# Altium project MB.PrjPcb (part 2 of 3)

## Sheet MB_pl_io.SchDoc: Материнская плата
size 420 x 297 mm; DrawnBy: В.Титов; DocumentNumber: ХХХХ.468179.001 Э3; SheetNumber: 4; SheetTotal: 7; DocumentType: Схема электрическая принципиальная; Title2: Питание процессора
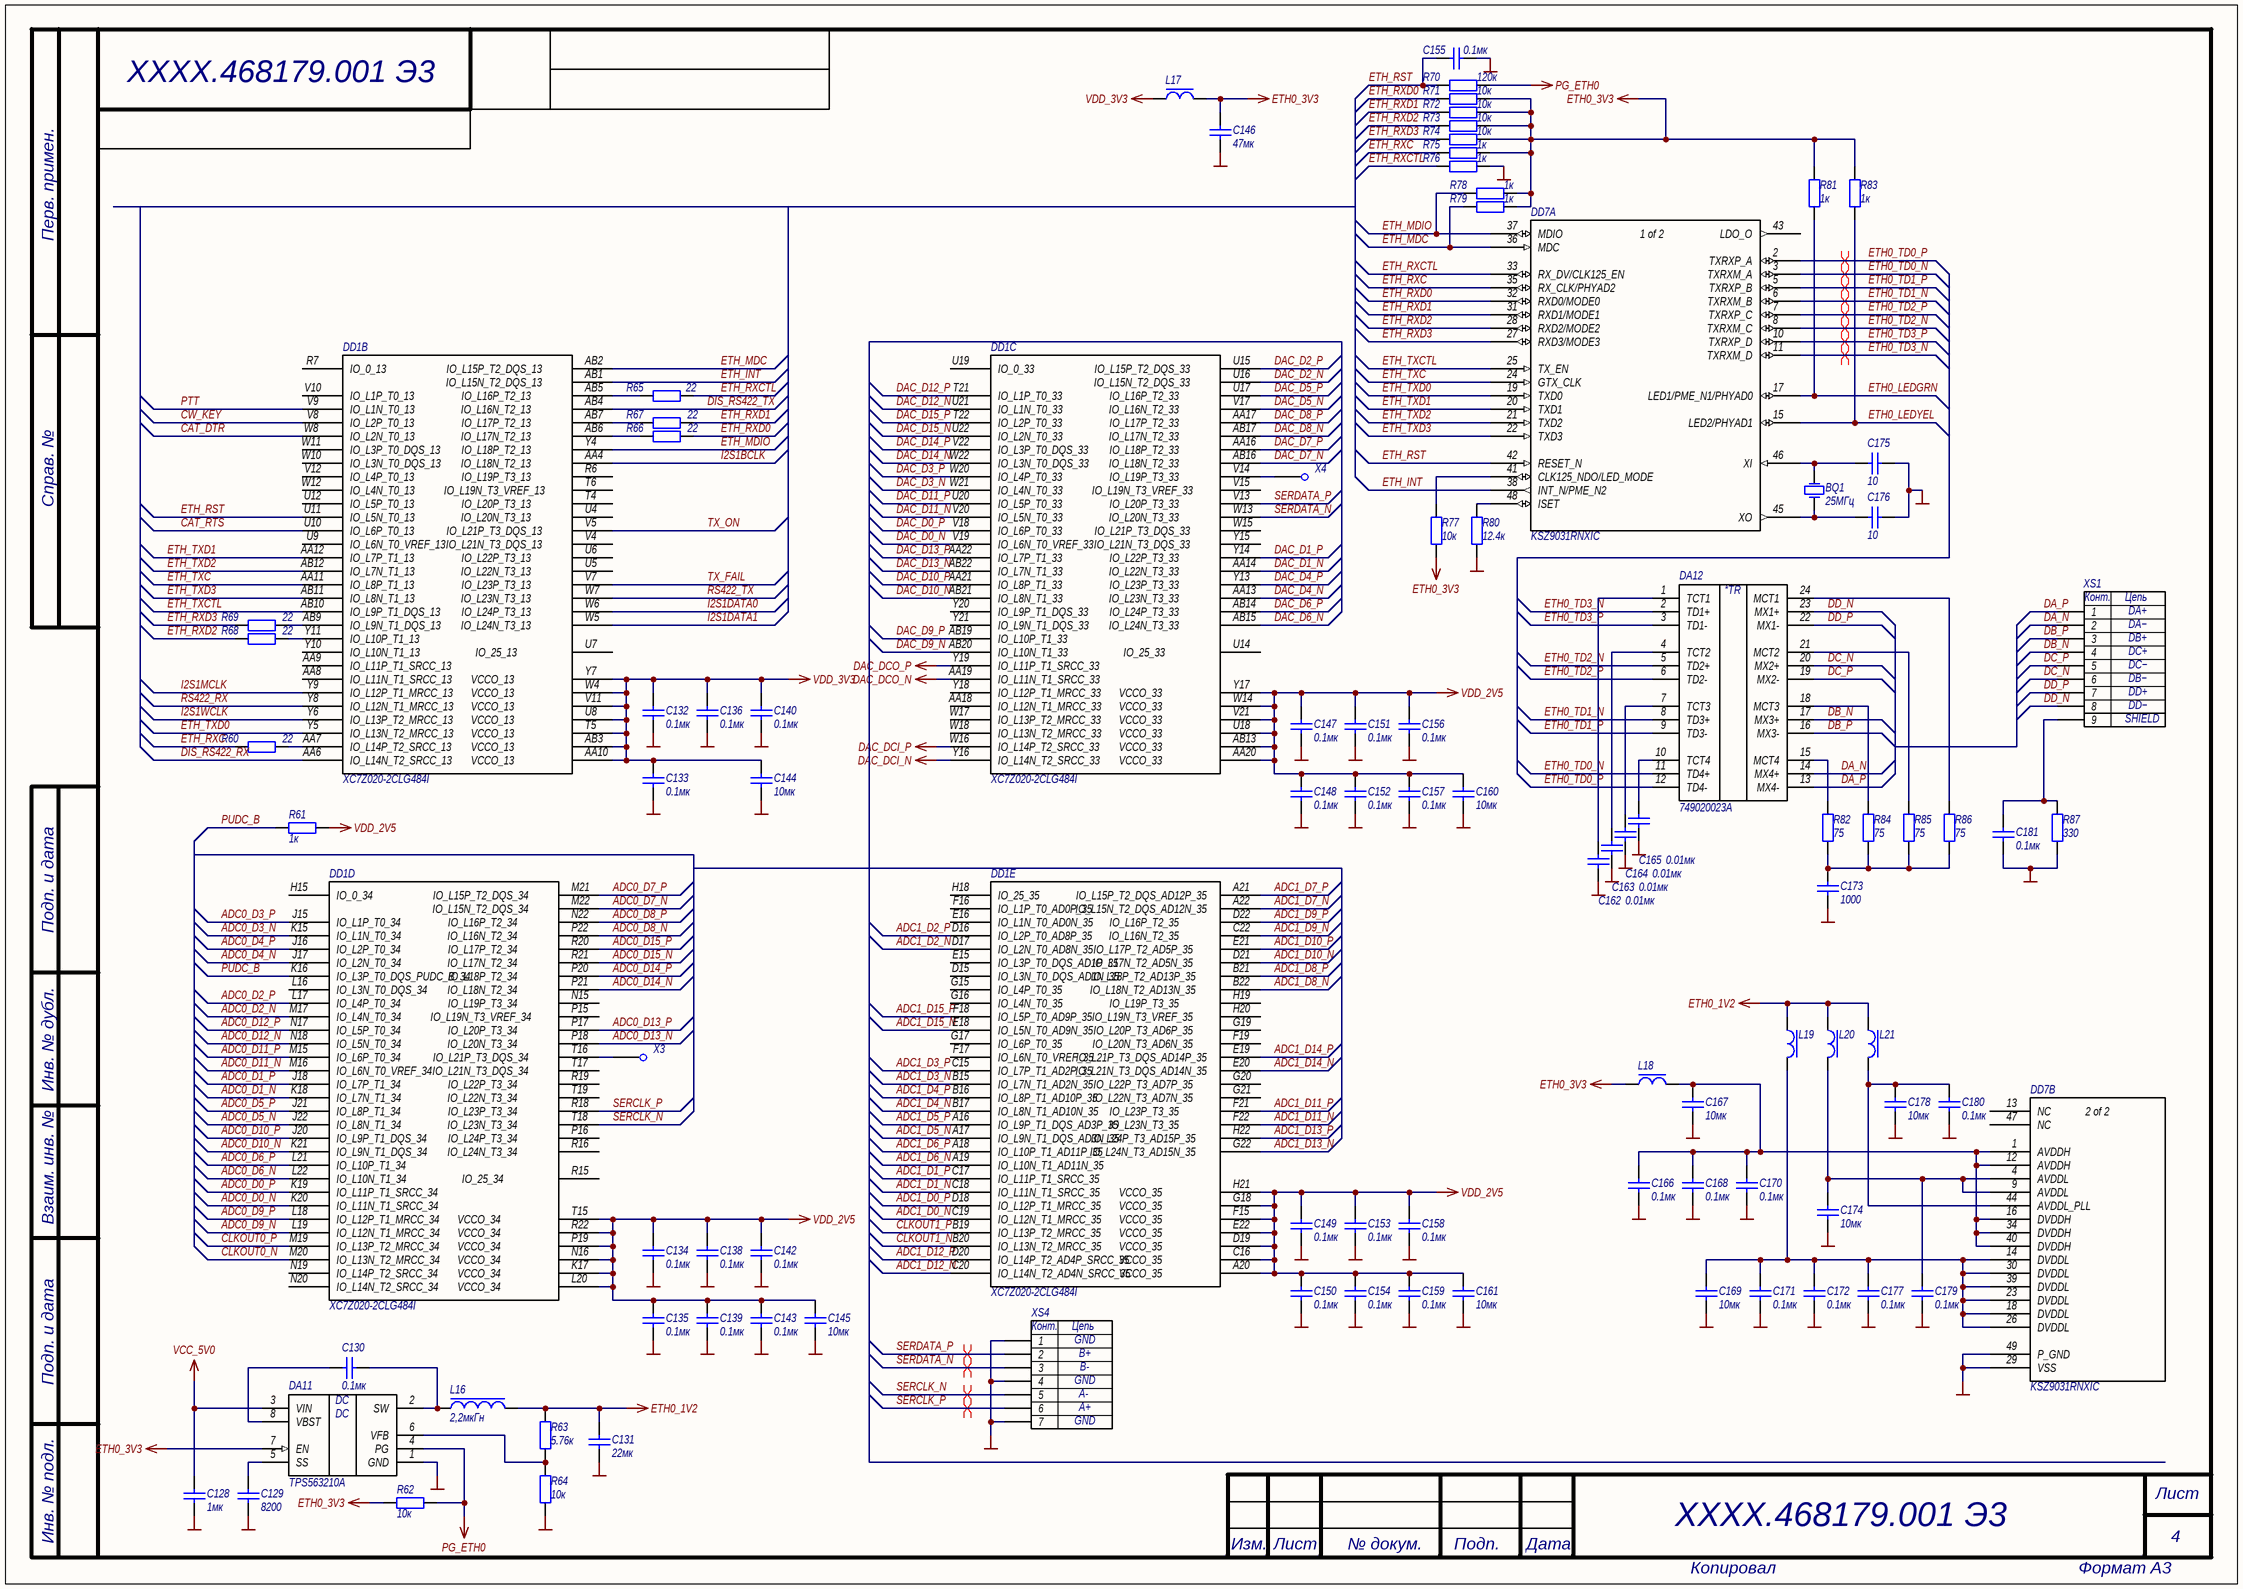
[diagram p3: MB_pl_io.SchDoc]

### Parts
BQ1  25МГц  [ABRACOM ABM10]
C128  1мк  [CAPC1005X06N]
C129  8200  [CAPC1005X06N]
C130  0.1мк  [CAPC1005X06N]
C131  22мк  [CAPC2012X12L]
C132  0.1мк  [CAPC1005X06N]
C133  0.1мк  [CAPC1005X06N]
C134  0.1мк  [CAPC1005X06N]
C135  0.1мк  [CAPC1005X06N]
C136  0.1мк  [CAPC1005X06N]
C138  0.1мк  [CAPC1005X06N]
C139  0.1мк  [CAPC1005X06N]
C140  0.1мк  [CAPC1005X06N]
C142  0.1мк  [CAPC1005X06N]
C143  0.1мк  [CAPC1005X06N]
C144  10мк  [CAPC1608X08L]
C145  10мк  [CAPC1608X08L]
C146  47мк  [CAPC2012X12L]
C147  0.1мк  [CAPC1005X06N]
C148  0.1мк  [CAPC1005X06N]
C149  0.1мк  [CAPC1005X06N]
C150  0.1мк  [CAPC1005X06N]
C151  0.1мк  [CAPC1005X06N]
C152  0.1мк  [CAPC1005X06N]
C153  0.1мк  [CAPC1005X06N]
C154  0.1мк  [CAPC1005X06N]
C155  0.1мк  [CAPC1005X06N]
C156  0.1мк  [CAPC1005X06N]
C157  0.1мк  [CAPC1005X06N]
C158  0.1мк  [CAPC1005X06N]
C159  0.1мк  [CAPC1005X06N]
C160  10мк  [CAPC1608X08L]
C161  10мк  [CAPC1608X08L]
C162  0.01мк  [CAPC1005X06N]
C163  0.01мк  [CAPC1005X06N]
C164  0.01мк  [CAPC1005X06N]
C165  0.01мк  [CAPC1005X06N]
C166  0.1мк  [CAPC1005X06N]
C167  10мк  [CAPC1608X08L]
C168  0.1мк  [CAPC1005X06N]
C169  10мк  [CAPC1608X08L]
C170  0.1мк  [CAPC1005X06N]
C171  0.1мк  [CAPC1005X06N]
C172  0.1мк  [CAPC1005X06N]
C173  1000  [CAPC1005X06N]
C174  10мк  [CAPC1608X08L]
C175  10  [CAPC1005X06N]
C176  10  [CAPC1005X06N]
C177  0.1мк  [CAPC1005X06N]
C178  10мк  [CAPC1608X08L]
C179  0.1мк  [CAPC1005X06N]
C180  0.1мк  [CAPC1005X06N]
C181  0.1мк  [CAPC1608X08L]
DA11  TPS563210A  [TSOP65P280X110-8N]
DA12  749020023A  [749020023A]
DD1  XC7Z020-2CLG484I  [BGA484C80P22X22_1900X1900X160]  (parts B,C,D,E of 9)
DD7  KSZ9031RNXIC  [QFN50P700X700-48V6M]  (parts A,B of 2)
L16  2,2мкГн  [CSAB0420]
L17  BLM18PG121SN1D  [INDC1608X08L]  (value not drawn)
L18  BLM18PG121SN1D  [INDC1608X08L]  (value not drawn)
L19  BLM18PG121SN1D  [INDC1608X08L]  (value not drawn)
L20  BLM18PG121SN1D  [INDC1608X08L]  (value not drawn)
L21  BLM18PG121SN1D  [INDC1608X08L]  (value not drawn)
R60  22  [RESC1005X06N]
R61  1к  [RESC1005X06N]
R62  10к  [RESC1005X06N]
R63  5.76к  [RESC1005X06N]
R64  10к  [RESC1005X06N]
R65  22  [RESC1005X06N]
R66  22  [RESC1005X06N]
R67  22  [RESC1005X06N]
R68  22  [RESC1005X06N]
R69  22  [RESC1005X06N]
R70  120к  [RESC1005X06N]
R71  10к  [RESC1005X06N]
R72  10к  [RESC1005X06N]
R73  10к  [RESC1005X06N]
R74  10к  [RESC1005X06N]
R75  1к  [RESC1005X06N]
R76  1к  [RESC1005X06N]
R77  10к  [RESC1005X06N]
R78  1к  [RESC1005X06N]
R79  1к  [RESC1005X06N]
R80  12.4к  [RESC1005X06N]
R81  1к  [RESC1005X06N]
R82  75  [RESC1005X06N]
R83  1к  [RESC1005X06N]
R84  75  [RESC1005X06N]
R85  75  [RESC1005X06N]
R86  75  [RESC1005X06N]
R87  330  [RESC1005X06N]
X3  Конструктивный элемент  [PIN2_PROBE]  (value not drawn)  (no BOM)
X4  Конструктивный элемент  [PIN2_PROBE]  (value not drawn)  (no BOM)
XS1  TJ16S-8P8C  [KLS12-107L]  (value not drawn)
XS4  KLS1-SATA001  [KLS1-SATA001]  (value not drawn)

### Nets
DAC_DCI_N: DD1.Y16(IO_L14N_T2_SRCC_33)
DAC_DCI_P: DD1.W16(IO_L14P_T2_SRCC_33)
DAC_DCO_N: DD1.AA19(IO_L11N_T1_SRCC_33)
DAC_DCO_P: DD1.Y19(IO_L11P_T1_SRCC_33)
ETH0_1V2: C131.2 L16.2 L19.1 L20.1 L21.1 R63.2
ETH0_3V3: C146.2 DA11.7(EN) L17.2 L18.1 R62.2 R71.2 R72.2 R73.2 R74.2 R75.2 R77.2 R78.2 R79.2 R81.1 R83.1
GND: C128.1 C129.1 C131.1 C132.1 C133.1 C134.1 C135.1 C136.1 C138.1 C139.1 C140.1 C142.1 C143.1 C144.1 C145.1 C146.1 C147.1 C148.1 C149.1 C150.1 C151.1 C152.1 C153.1 C154.1 C155.1 C156.1 C157.1 C158.1 C159.1 C160.1 C161.1 C162.1 C163.1 C164.1 C165.1 C166.1 C167.1 C168.1 C169.1 C170.1 C171.1 C172.1 C173.2 C174.1 C175.1 C176.1 C177.1 C178.1 C179.1 C180.1 C181.2 DA11.1(GND) DD7.29(VSS) DD7.49(P_GND) R64.2 R76.2 R80.2 R87.2 XS4.1 XS4.4 XS4.7
PG_ETH0: DA11.4(PG) R62.1 R70.2
VCC_5V0: C128.2 DA11.3(VIN)
VDD_2V5: C134.2 C135.2 C138.2 C139.2 C142.2 C143.2 C145.2 C147.2 C148.2 C149.2 C150.2 C151.2 C152.2 C153.2 C154.2 C156.2 C157.2 C158.2 C159.2 C160.2 C161.2 DD1.A20(VCCO_35) DD1.AA20(VCCO_33) DD1.AB13(VCCO_33) DD1.C16(VCCO_35) DD1.D19(VCCO_35) DD1.E22(VCCO_35) DD1.F15(VCCO_35) DD1.G18(VCCO_35) DD1.H21(VCCO_35) DD1.K17(VCCO_34) DD1.L20(VCCO_34) DD1.N16(VCCO_34) DD1.P19(VCCO_34) DD1.R22(VCCO_34) DD1.T15(VCCO_34) DD1.U18(VCCO_33) DD1.V21(VCCO_33) DD1.W14(VCCO_33) DD1.Y17(VCCO_33) R61.2
VDD_3V3: C132.2 C133.2 C136.2 C140.2 C144.2 DD1.AA10(VCCO_13) DD1.AB3(VCCO_13) DD1.T5(VCCO_13) DD1.U8(VCCO_13) DD1.V11(VCCO_13) DD1.W4(VCCO_13) DD1.Y7(VCCO_13) L17.1
ADC0_D0_N: DD1.K20(IO_L11N_T1_SRCC_34)
ADC0_D0_P: DD1.K19(IO_L11P_T1_SRCC_34)
ADC0_D1_N: DD1.K18(IO_L7N_T1_34)
ADC0_D1_P: DD1.J18(IO_L7P_T1_34)
ADC0_D2_N: DD1.M17(IO_L4N_T0_34)
ADC0_D2_P: DD1.L17(IO_L4P_T0_34)
ADC0_D3_N: DD1.K15(IO_L1N_T0_34)
ADC0_D3_P: DD1.J15(IO_L1P_T0_34)
ADC0_D4_N: DD1.J17(IO_L2N_T0_34)
ADC0_D4_P: DD1.J16(IO_L2P_T0_34)
ADC0_D5_N: DD1.J22(IO_L8N_T1_34)
ADC0_D5_P: DD1.J21(IO_L8P_T1_34)
ADC0_D6_N: DD1.L22(IO_L10N_T1_34)
ADC0_D6_P: DD1.L21(IO_L10P_T1_34)
ADC0_D7_N: DD1.M22(IO_L15N_T2_DQS_34)
ADC0_D7_P: DD1.M21(IO_L15P_T2_DQS_34)
ADC0_D8_N: DD1.P22(IO_L16N_T2_34)
ADC0_D8_P: DD1.N22(IO_L16P_T2_34)
ADC0_D9_N: DD1.L19(IO_L12N_T1_MRCC_34)
ADC0_D9_P: DD1.L18(IO_L12P_T1_MRCC_34)
ADC0_D10_N: DD1.K21(IO_L9N_T1_DQS_34)
ADC0_D10_P: DD1.J20(IO_L9P_T1_DQS_34)
ADC0_D11_N: DD1.M16(IO_L6N_T0_VREF_34)
ADC0_D11_P: DD1.M15(IO_L6P_T0_34)
ADC0_D12_N: DD1.N18(IO_L5N_T0_34)
ADC0_D12_P: DD1.N17(IO_L5P_T0_34)
ADC0_D13_N: DD1.P18(IO_L20N_T3_34)
ADC0_D13_P: DD1.P17(IO_L20P_T3_34)
ADC0_D14_N: DD1.P21(IO_L18N_T2_34)
ADC0_D14_P: DD1.P20(IO_L18P_T2_34)
ADC0_D15_N: DD1.R21(IO_L17N_T2_34)
ADC0_D15_P: DD1.R20(IO_L17P_T2_34)
ADC1_D0_N: DD1.C19(IO_L12N_T1_MRCC_35)
ADC1_D0_P: DD1.D18(IO_L12P_T1_MRCC_35)
ADC1_D1_N: DD1.C18(IO_L11N_T1_SRCC_35)
ADC1_D1_P: DD1.C17(IO_L11P_T1_SRCC_35)
ADC1_D2_N: DD1.D17(IO_L2N_T0_AD8N_35)
ADC1_D2_P: DD1.D16(IO_L2P_T0_AD8P_35)
ADC1_D3_N: DD1.B15(IO_L7N_T1_AD2N_35)
ADC1_D3_P: DD1.C15(IO_L7P_T1_AD2P_35)
ADC1_D4_N: DD1.B17(IO_L8N_T1_AD10N_35)
ADC1_D4_P: DD1.B16(IO_L8P_T1_AD10P_35)
ADC1_D5_N: DD1.A17(IO_L9N_T1_DQS_AD3N_35)
ADC1_D5_P: DD1.A16(IO_L9P_T1_DQS_AD3P_35)
ADC1_D6_N: DD1.A19(IO_L10N_T1_AD11N_35)
ADC1_D6_P: DD1.A18(IO_L10P_T1_AD11P_35)
ADC1_D7_N: DD1.A22(IO_L15N_T2_DQS_AD12N_35)
ADC1_D7_P: DD1.A21(IO_L15P_T2_DQS_AD12P_35)
ADC1_D8_N: DD1.B22(IO_L18N_T2_AD13N_35)
ADC1_D8_P: DD1.B21(IO_L18P_T2_AD13P_35)
ADC1_D9_N: DD1.C22(IO_L16N_T2_35)
ADC1_D9_P: DD1.D22(IO_L16P_T2_35)
ADC1_D10_N: DD1.D21(IO_L17N_T2_AD5N_35)
ADC1_D10_P: DD1.E21(IO_L17P_T2_AD5P_35)
ADC1_D11_N: DD1.F22(IO_L23N_T3_35)
ADC1_D11_P: DD1.F21(IO_L23P_T3_35)
ADC1_D12_N: DD1.C20(IO_L14N_T2_AD4N_SRCC_35)
ADC1_D12_P: DD1.D20(IO_L14P_T2_AD4P_SRCC_35)
ADC1_D13_N: DD1.G22(IO_L24N_T3_AD15N_35)
ADC1_D13_P: DD1.H22(IO_L24P_T3_AD15P_35)
ADC1_D14_N: DD1.E20(IO_L21N_T3_DQS_AD14N_35)
ADC1_D14_P: DD1.E19(IO_L21P_T3_DQS_AD14P_35)
ADC1_D15_N: DD1.E18(IO_L5N_T0_AD9N_35)
ADC1_D15_P: DD1.F18(IO_L5P_T0_AD9P_35)
CAT_DTR: DD1.W8(IO_L2N_T0_13)
CAT_RTS: DD1.U10(IO_L6P_T0_13)
CLKOUT0_N: DD1.M20(IO_L13N_T2_MRCC_34)
CLKOUT0_P: DD1.M19(IO_L13P_T2_MRCC_34)
CLKOUT1_N: DD1.B20(IO_L13N_T2_MRCC_35)
CLKOUT1_P: DD1.B19(IO_L13P_T2_MRCC_35)
CW_KEY: DD1.V8(IO_L2P_T0_13)
DA_N: DA12.14(MX4+) XS1.2
DA_P: DA12.13(MX4-) XS1.1
DAC_D0_N: DD1.V19(IO_L6N_T0_VREF_33)
DAC_D0_P: DD1.V18(IO_L6P_T0_33)
DAC_D1_N: DD1.AA14(IO_L22N_T3_33)
DAC_D1_P: DD1.Y14(IO_L22P_T3_33)
DAC_D2_N: DD1.U16(IO_L15N_T2_DQS_33)
DAC_D2_P: DD1.U15(IO_L15P_T2_DQS_33)
DAC_D3_N: DD1.W21(IO_L4N_T0_33)
DAC_D3_P: DD1.W20(IO_L4P_T0_33)
DAC_D4_N: DD1.AA13(IO_L23N_T3_33)
DAC_D4_P: DD1.Y13(IO_L23P_T3_33)
DAC_D5_N: DD1.V17(IO_L16N_T2_33)
DAC_D5_P: DD1.U17(IO_L16P_T2_33)
DAC_D6_N: DD1.AB15(IO_L24N_T3_33)
DAC_D6_P: DD1.AB14(IO_L24P_T3_33)
DAC_D7_N: DD1.AB16(IO_L18N_T2_33)
DAC_D7_P: DD1.AA16(IO_L18P_T2_33)
DAC_D8_N: DD1.AB17(IO_L17N_T2_33)
DAC_D8_P: DD1.AA17(IO_L17P_T2_33)
DAC_D9_N: DD1.AB20(IO_L10N_T1_33)
DAC_D9_P: DD1.AB19(IO_L10P_T1_33)
DAC_D10_N: DD1.AB21(IO_L8N_T1_33)
DAC_D10_P: DD1.AA21(IO_L8P_T1_33)
DAC_D11_N: DD1.V20(IO_L5N_T0_33)
DAC_D11_P: DD1.U20(IO_L5P_T0_33)
DAC_D12_N: DD1.U21(IO_L1N_T0_33)
DAC_D12_P: DD1.T21(IO_L1P_T0_33)
DAC_D13_N: DD1.AB22(IO_L7N_T1_33)
DAC_D13_P: DD1.AA22(IO_L7P_T1_33)
DAC_D14_N: DD1.W22(IO_L3N_T0_DQS_33)
DAC_D14_P: DD1.V22(IO_L3P_T0_DQS_33)
DAC_D15_N: DD1.U22(IO_L2N_T0_33)
DAC_D15_P: DD1.T22(IO_L2P_T0_33)
DB_N: DA12.17(MX3+) XS1.4
DB_P: DA12.16(MX3-) XS1.3
DC_N: DA12.20(MX2+) XS1.6
DC_P: DA12.19(MX2-) XS1.5
DD_N: DA12.23(MX1+) XS1.8
DD_P: DA12.22(MX1-) XS1.7
DIS_RS422_RX: DD1.AA6(IO_L14N_T2_SRCC_13)
DIS_RS422_TX: DD1.AB4(IO_L16N_T2_13)
ETH0_LEDGRN: DD7.17(LED1/PME_N1/PHYAD0) R81.2
ETH0_LEDYEL: DD7.15(LED2/PHYAD1) R83.2
ETH0_TD0_N: DA12.11(TD4+) DD7.3(TXRXM_A)
ETH0_TD0_P: DA12.12(TD4-) DD7.2(TXRXP_A)
ETH0_TD1_N: DA12.8(TD3+) DD7.6(TXRXM_B)
ETH0_TD1_P: DA12.9(TD3-) DD7.5(TXRXP_B)
ETH0_TD2_N: DA12.5(TD2+) DD7.8(TXRXM_C)
ETH0_TD2_P: DA12.6(TD2-) DD7.7(TXRXP_C)
ETH0_TD3_N: DA12.2(TD1+) DD7.11(TXRXM_D)
ETH0_TD3_P: DA12.3(TD1-) DD7.10(TXRXP_D)
ETH_INT: DD1.AB1(IO_L15N_T2_DQS_13) DD7.38(INT_N/PME_N2)
ETH_MDC: DD1.AB2(IO_L15P_T2_DQS_13) DD7.36(MDC) R79.1
ETH_MDIO: DD1.Y4(IO_L18P_T2_13) DD7.37(MDIO) R78.1
ETH_RST: C155.2 DD1.U11(IO_L5N_T0_13) DD7.42(RESET_N) R70.1
ETH_RXC: DD7.35(RX_CLK/PHYAD2) R60.1 R75.1
ETH_RXCTL: DD7.33(RX_DV/CLK125_EN) R65.1 R76.1
ETH_RXD0: DD7.32(RXD0/MODE0) R66.2 R71.1
ETH_RXD1: DD7.31(RXD1/MODE1) R67.2 R72.1
ETH_RXD2: DD7.28(RXD2/MODE2) R68.1 R73.1
ETH_RXD3: DD7.27(RXD3/MODE3) R69.1 R74.1
ETH_TXC: DD1.AA11(IO_L8P_T1_13) DD7.24(GTX_CLK)
ETH_TXCTL: DD1.AB10(IO_L9P_T1_DQS_13) DD7.25(TX_EN)
ETH_TXD0: DD1.Y5(IO_L13N_T2_MRCC_13) DD7.19(TXD0)
ETH_TXD1: DD1.AA12(IO_L7P_T1_13) DD7.20(TXD1)
ETH_TXD2: DD1.AB12(IO_L7N_T1_13) DD7.21(TXD2)
ETH_TXD3: DD1.AB11(IO_L8N_T1_13) DD7.22(TXD3)
I2S1BCLK: DD1.AA4(IO_L18N_T2_13)
I2S1DATA0: DD1.W6(IO_L24P_T3_13)
I2S1DATA1: DD1.W5(IO_L24N_T3_13)
I2S1MCLK: DD1.Y9(IO_L12P_T1_MRCC_13)
I2S1WCLK: DD1.Y6(IO_L13P_T2_MRCC_13)
PTT: DD1.V9(IO_L1N_T0_13)
PUDC_B: DD1.K16(IO_L3P_T0_DQS_PUDC_B_34) R61.1
RS422_RX: DD1.Y8(IO_L12N_T1_MRCC_13)
RS422_TX: DD1.W7(IO_L23N_T3_13)
SERCLK_N: DD1.T18(IO_L23N_T3_34) XS4.5
SERCLK_P: DD1.R18(IO_L23P_T3_34) XS4.6
SERDATA_N: DD1.W13(IO_L20N_T3_33) XS4.3
SERDATA_P: DD1.V13(IO_L20P_T3_33) XS4.2
TX_FAIL: DD1.V7(IO_L23P_T3_13)
TX_ON: DD1.V5(IO_L21P_T3_DQS_13)
NetBQ1_1: BQ1.1(OSC1) C175.2 DD7.46(XI)
NetBQ1_3: BQ1.3(OSC2) C176.2 DD7.45(XO)
NetC129_2: C129.2 DA11.5(SS)
NetC130_1: C130.1 DA11.2(SW) L16.1
NetC130_2: C130.2 DA11.8(VBST)
NetC162_2: C162.2 DA12.1(TCT1)
NetC163_2: C163.2 DA12.4(TCT2)
NetC164_2: C164.2 DA12.7(TCT3)
NetC165_2: C165.2 DA12.10(TCT4)
NetC166_2: C166.2 C167.2 C168.2 C170.2 DD7.1(AVDDH) DD7.12(AVDDH) DD7.16(DVDDH) DD7.34(DVDDH) DD7.40(DVDDH) L18.2
NetC169_2: C169.2 C171.2 C172.2 C177.2 DD7.14(DVDDL) DD7.18(DVDDL) DD7.23(DVDDL) DD7.26(DVDDL) DD7.30(DVDDL) DD7.39(DVDDL) L19.2
NetC173_1: C173.1 R82.2 R84.2 R85.2 R86.2
NetC174_2: C174.2 C179.2 DD7.4(AVDDL) DD7.9(AVDDL) L20.2
NetC178_2: C178.2 C180.2 DD7.44(AVDDL_PLL) L21.2
NetC181_1: C181.1 R87.1 XS1.9
NetDA11_6: DA11.6(VFB) R63.1 R64.1
NetDA12_15: DA12.15(MCT4) R82.1
NetDA12_18: DA12.18(MCT3) R84.1
NetDA12_21: DA12.21(MCT2) R85.1
NetDA12_24: DA12.24(MCT1) R86.1
NetDD1_AA7   : DD1.AA7(IO_L14P_T2_SRCC_13) R60.2
NetDD1_AB5   : DD1.AB5(IO_L16P_T2_13) R65.2
NetDD1_AB6   : DD1.AB6(IO_L17N_T2_13) R66.1
NetDD1_AB7   : DD1.AB7(IO_L17P_T2_13) R67.1
NetDD1_AB9   : DD1.AB9(IO_L9N_T1_DQS_13) R69.2
NetDD1_T16   : DD1.T16(IO_L21P_T3_DQS_34) X3.1
NetDD1_V14   : DD1.V14(IO_L19P_T3_33) X4.1
NetDD1_Y11   : DD1.Y11(IO_L10P_T1_13) R68.2
NetDD7_41: DD7.41(CLK125_NDO/LED_MODE) R77.1
NetDD7_48: DD7.48(ISET) R80.1

Not connected (* = marked no-connect by the designer): DD1 AA8   (IO_L11N_T1_SRCC_13_______) AA9   (IO_L11P_T1_SRCC_13_______) AA18  (IO_L12N_T1_MRCC_33_______) D15   (IO_L3N_T0_DQS_AD1N_35____) E15   (IO_L3P_T0_DQS_AD1P_35____) E16   (IO_L1N_T0_AD0N_35________) F16   (IO_L1P_T0_AD0P_35________) F17   (IO_L6N_T0_VREF_35________) F19   (IO_L20N_T3_AD6N_35_______) G15   (IO_L4P_T0_35_____________) G16   (IO_L4N_T0_35_____________) G17   (IO_L6P_T0_35_____________) G19   (IO_L20P_T3_AD6P_35_______) G20   (IO_L22P_T3_AD7P_35_______) G21   (IO_L22N_T3_AD7N_35_______) H15   (IO_0_34__________________) H18   (IO_25_35_________________) H19   (IO_L19P_T3_35____________) H20   (IO_L19N_T3_VREF_35_______) L16   (IO_L3N_T0_DQS_34_________) N15   (IO_L19P_T3_34____________) N19   (IO_L14P_T2_SRCC_34_______) N20   (IO_L14N_T2_SRCC_34_______) P15   (IO_L19N_T3_VREF_34_______) P16   (IO_L24P_T3_34____________) R6    (IO_L19P_T3_13____________) R7    (IO_0_13__________________) R15   (IO_25_34_________________) R16   (IO_L24N_T3_34____________) R19   (IO_L22P_T3_34____________) T4    (IO_L20P_T3_13____________) T6    (IO_L19N_T3_VREF_13_______) T17   (IO_L21N_T3_DQS_34________) T19   (IO_L22N_T3_34____________) U4    (IO_L20N_T3_13____________) U5    (IO_L22N_T3_13____________) U6    (IO_L22P_T3_13____________) U7    (IO_25_13_________________) U9    (IO_L6N_T0_VREF_13________) U12   (IO_L5P_T0_13_____________) U14   (IO_25_33_________________) U19   (IO_0_33__________________) V4    (IO_L21N_T3_DQS_13________) V10   (IO_L1P_T0_13_____________) V12   (IO_L4P_T0_13_____________) V15   (IO_L19N_T3_VREF_33_______) W10   (IO_L3N_T0_DQS_13_________) W11   (IO_L3P_T0_DQS_13_________) W12   (IO_L4N_T0_13_____________) W15   (IO_L21P_T3_DQS_33________) W17   (IO_L13P_T2_MRCC_33_______) W18   (IO_L13N_T2_MRCC_33_______) Y10   (IO_L10N_T1_13____________) Y15   (IO_L21N_T3_DQS_33________) Y18   (IO_L12P_T1_MRCC_33_______) Y20   (IO_L9P_T1_DQS_33_________) Y21   (IO_L9N_T1_DQS_33_________); DD7 13(NC) 43(LDO_O) 47(NC)

### Layout directives
differential pair: ETH0_TD0_N, ETH0_TD0_P, ETH0_TD1_N, ETH0_TD1_P, ETH0_TD2_N, ETH0_TD2_P, ETH0_TD3_N, ETH0_TD3_P, SERCLK_N, SERCLK_P, SERDATA_N, SERDATA_P

### Notes on the sheet
- Перв. примен.
- Справ. №
- Подп. и дата
- Инв. № дубл.
- Взаим. инв. №
- Инв. № подл.
- Лист
- Изм.
- № докум.
- Подп.
- Дата
- Копировал
- Формат А3
- (in symbol Микросхема KSZ9031RNXIC, part A) 1 of 2
- (in symbol Микросхема KSZ9031RNXIC, part B) 2 of 2
- (in symbol Микросхема TPS563210A) DC
- (in symbol Сборка трансформаторов 749020023A) *TR
- (in symbol Соединитель KLS1-SATA001) Конт.; Цепь; GND; B+; B-; A-; A+
- (in symbol Соединитель KLS12-107L-2-8P8C-0) Конт.; Цепь; DA+; DA−; DB+; DC+; DC−; DB−; DD+; DD−; SHIELD

### Library data of the parts
BQ1 = Кварц ABM10-25.000MHZ-D30: Резонатор кварцевый; Manufacturer: ABRACON; Tolerance: ±20 ppm; Value: 25МГц
C128 = Кер.ЧИП конд. 0402 1мкФ X5R 10%, 10В: as C?#4 on sheet MB_pwr_in_v2; PackageReference: 0402; Value: 1мк
C129 = Кер.ЧИП конд. 0402 8200пФ X7R 10%, 50В: Кер. ЧИП-конденсатор; Power/Voltage: 50В; TKE: X7R; Tolerance: ±20%; Value: 8200
C130 C132-C136 C138-C140 C142 C143 C147-C159 C166 C168 C170-C172 C177 C179 C180 = Кер.ЧИП конд. 0402 0.1мкФ X7R 10%, 16В: as C11 on sheet MB_pwr_in_v2; PackageReference: 0402; Value: 0.1мк
C131 = Кер.ЧИП конд. 0805 22мкФ X5R 10% 16В: Кер. ЧИП-конденсатор; Manufacturer: TDK; ManufacturerPartNumber: C2012X5R1C226KT; Power/Voltage: 16В; TKE: X5R; Tolerance: ±10%; Value: 22мк
C144 C145 C160 C161 C167 C169 C174 C178 = Кер.ЧИП конд. 0603 10мкФ X5R 20% 6.3В: Кер. ЧИП-конденсатор; Manufacturer: Murata; ManufacturerPartNumber: GRM188R61A106KE69D; Power/Voltage: 6.3В; TKE: X5R; Tolerance: ±20%; Value: 10мк
C146 = Кер.ЧИП конд. 0805 47мкФ X5R 20% 10В: Кер. ЧИП-конденсатор; Manufacturer: Murata; ManufacturerPartNumber: GRM21BR61A476ME15L; Power/Voltage: 10В; TKE: X5R; Tolerance: ±20%; Value: 47мк
C162-C165 = Кер.ЧИП конд. 0402 0.01мкФ X7R 10%, 50В: as C86 on sheet MB_ps_io; Value: 0.01мк
C173 = Кер.ЧИП конд. 0402 1000пФ NP0 5%, 50В: Кер. ЧИП-конденсатор; Power/Voltage: 50В; TKE: NPO; Tolerance: ±5%; Value: 1000; PackageReference: 0402
C175 C176 = Кер.ЧИП конд. 0402 10пФ NPO 5%, 50В: Кер. ЧИП-конденсатор; Power/Voltage: 50В; TKE: NPO; Tolerance: ±5%; PackageReference: 0402; Value: 10
C181 = Кер.ЧИП конд. 0603 0.1мкФ X7R 10% 50В: Кер. ЧИП-конденсатор; Manufacturer: Murata; ManufacturerPartNumber: GRM188R71H104KA93D; Power/Voltage: 50В; TKE: X7R; Tolerance: ±10%; Value: 0.1мк
DA11 = Микросхема TPS563210A: TPS56x210A, 4.5-V to 17-V Input, 2-A, 3-A Synchrono; Manufacturer: TI; Value: TPS563210A
DA12 = Сборка трансформаторов 749020023A: 1000BASE-T Magnetics Module; Manufacturer: Wurth Elektronik; Value: 749020023A
DD1 = Микросхема XC7Z020-2CLG484I: Zynq®-7000 SoC Family; Manufacturer: XILINX; Value: XC7Z020-2CLG484I; ComponentLink1Description: datasheet; ComponentLink1URL: https://www.xilinx.com/support/documentation/data_sheets/ds925-zynq-ultrascale-plus.pdf
DD7 = Микросхема KSZ9031RNXIC: Gigabit Ethernet Transceiver with Power Saving Features; SourceLibrary: Add_to_database_2020-10-19; Built_By: EMA_Cory; Vendor: Microchip; Datasheet: https://ww1.microchip.com/downloads/en/DeviceDoc/00002117F.pdf; Copyright: Copyright (C) 2018 Accelerated Designs. All rights reserved; Manufacturer_Part_Number: KSZ9031RNXIC; RefDes: RefDes; Type: DEV; Value: KSZ9031RNXIC
L16 = ЧИП индуктивность CSAB0420-2R2M: as L1 on sheet MB_pwr_in_v2; Value: 2,2мкГн
L17-L21 = ЧИП дроссель 0603 BLM18PG121SN1D: as L8 on sheet MB_pwr_in_v2; ManufacturerPartNumber: BLM18PG121SN1D; Value: BLM18PG121SN1D
R60 R65-R69 = Чип резистор 0402 22 Ом, 5%: ЧИП-резистор; Tolerance: ±5%; TKE: 100 ppm/°С; PackageReference: 0402; Value: 22
R61 R75 R76 R78 R79 R81 R83 = Чип резистор 0402 1 кОм, 5%: as R52 on sheet MB_ddr; PackageReference: 0402; Value: 1к
R62 = Чип резистор 0402 10 кОм, 1%: ЧИП-резистор; Tolerance: ±5%; TKE: 100 ppm/°С; PackageReference: 0402; Value: 10к
R63 = Чип резистор 0402 5,76 кОм, 1%: ЧИП-резистор; Tolerance: ±1%; TKE: 100 ppm/°С; PackageReference: 0402; Value: 5.76к
R64 R71-R74 R77 = Чип резистор 0402 10 кОм, 5%: as R8 on sheet MB_pwr_in_v2; PackageReference: 0402; Value: 10к
R70 = Чип резистор 0402 120 кОм, 5%: ЧИП-резистор; Tolerance: ±5%; TKE: 100 ppm/°С; PackageReference: 0402; Value: 120к
R80 = Чип резистор 0402 12.4 кОм, 1%: ЧИП-резистор; Tolerance: ±1%; TKE: 100 ppm/°С; PackageReference: 0402; Value: 12.4к
R82 R84-R86 = Чип резистор 0402 75 Ом, 5%: ЧИП-резистор; Tolerance: ±5%; TKE: 100 ppm/°С; PackageReference: 0402; Value: 75
R87 = Чип резистор 0402 330 Ом, 5%: ЧИП-резистор; Tolerance: ±5%; TKE: 100 ppm/°С; PackageReference: 0402; Value: 330
X3 X4 = Соединение под пайку: Соединитель; Value: Конструктивный элемент
XS1 = Соединитель KLS12-107L-2-8P8C-0: Modular Jack RJ45; Manufacturer: KLS; Value: TJ16S-8P8C
XS4 = Соединитель KLS1-SATA001: SATA Type A 7P Male Connector,SMD; Manufacturer: KLS; Value: KLS1-SATA001

## Sheet MB_adc_clk.SchDoc: Материнская плата
size 420 x 297 mm; DrawnBy: В.Титов; DocumentNumber: ХХХХ.468179.001 Э3; SheetNumber: 5; SheetTotal: 7; DocumentType: Схема электрическая принципиальная; Title2: Питание процессора
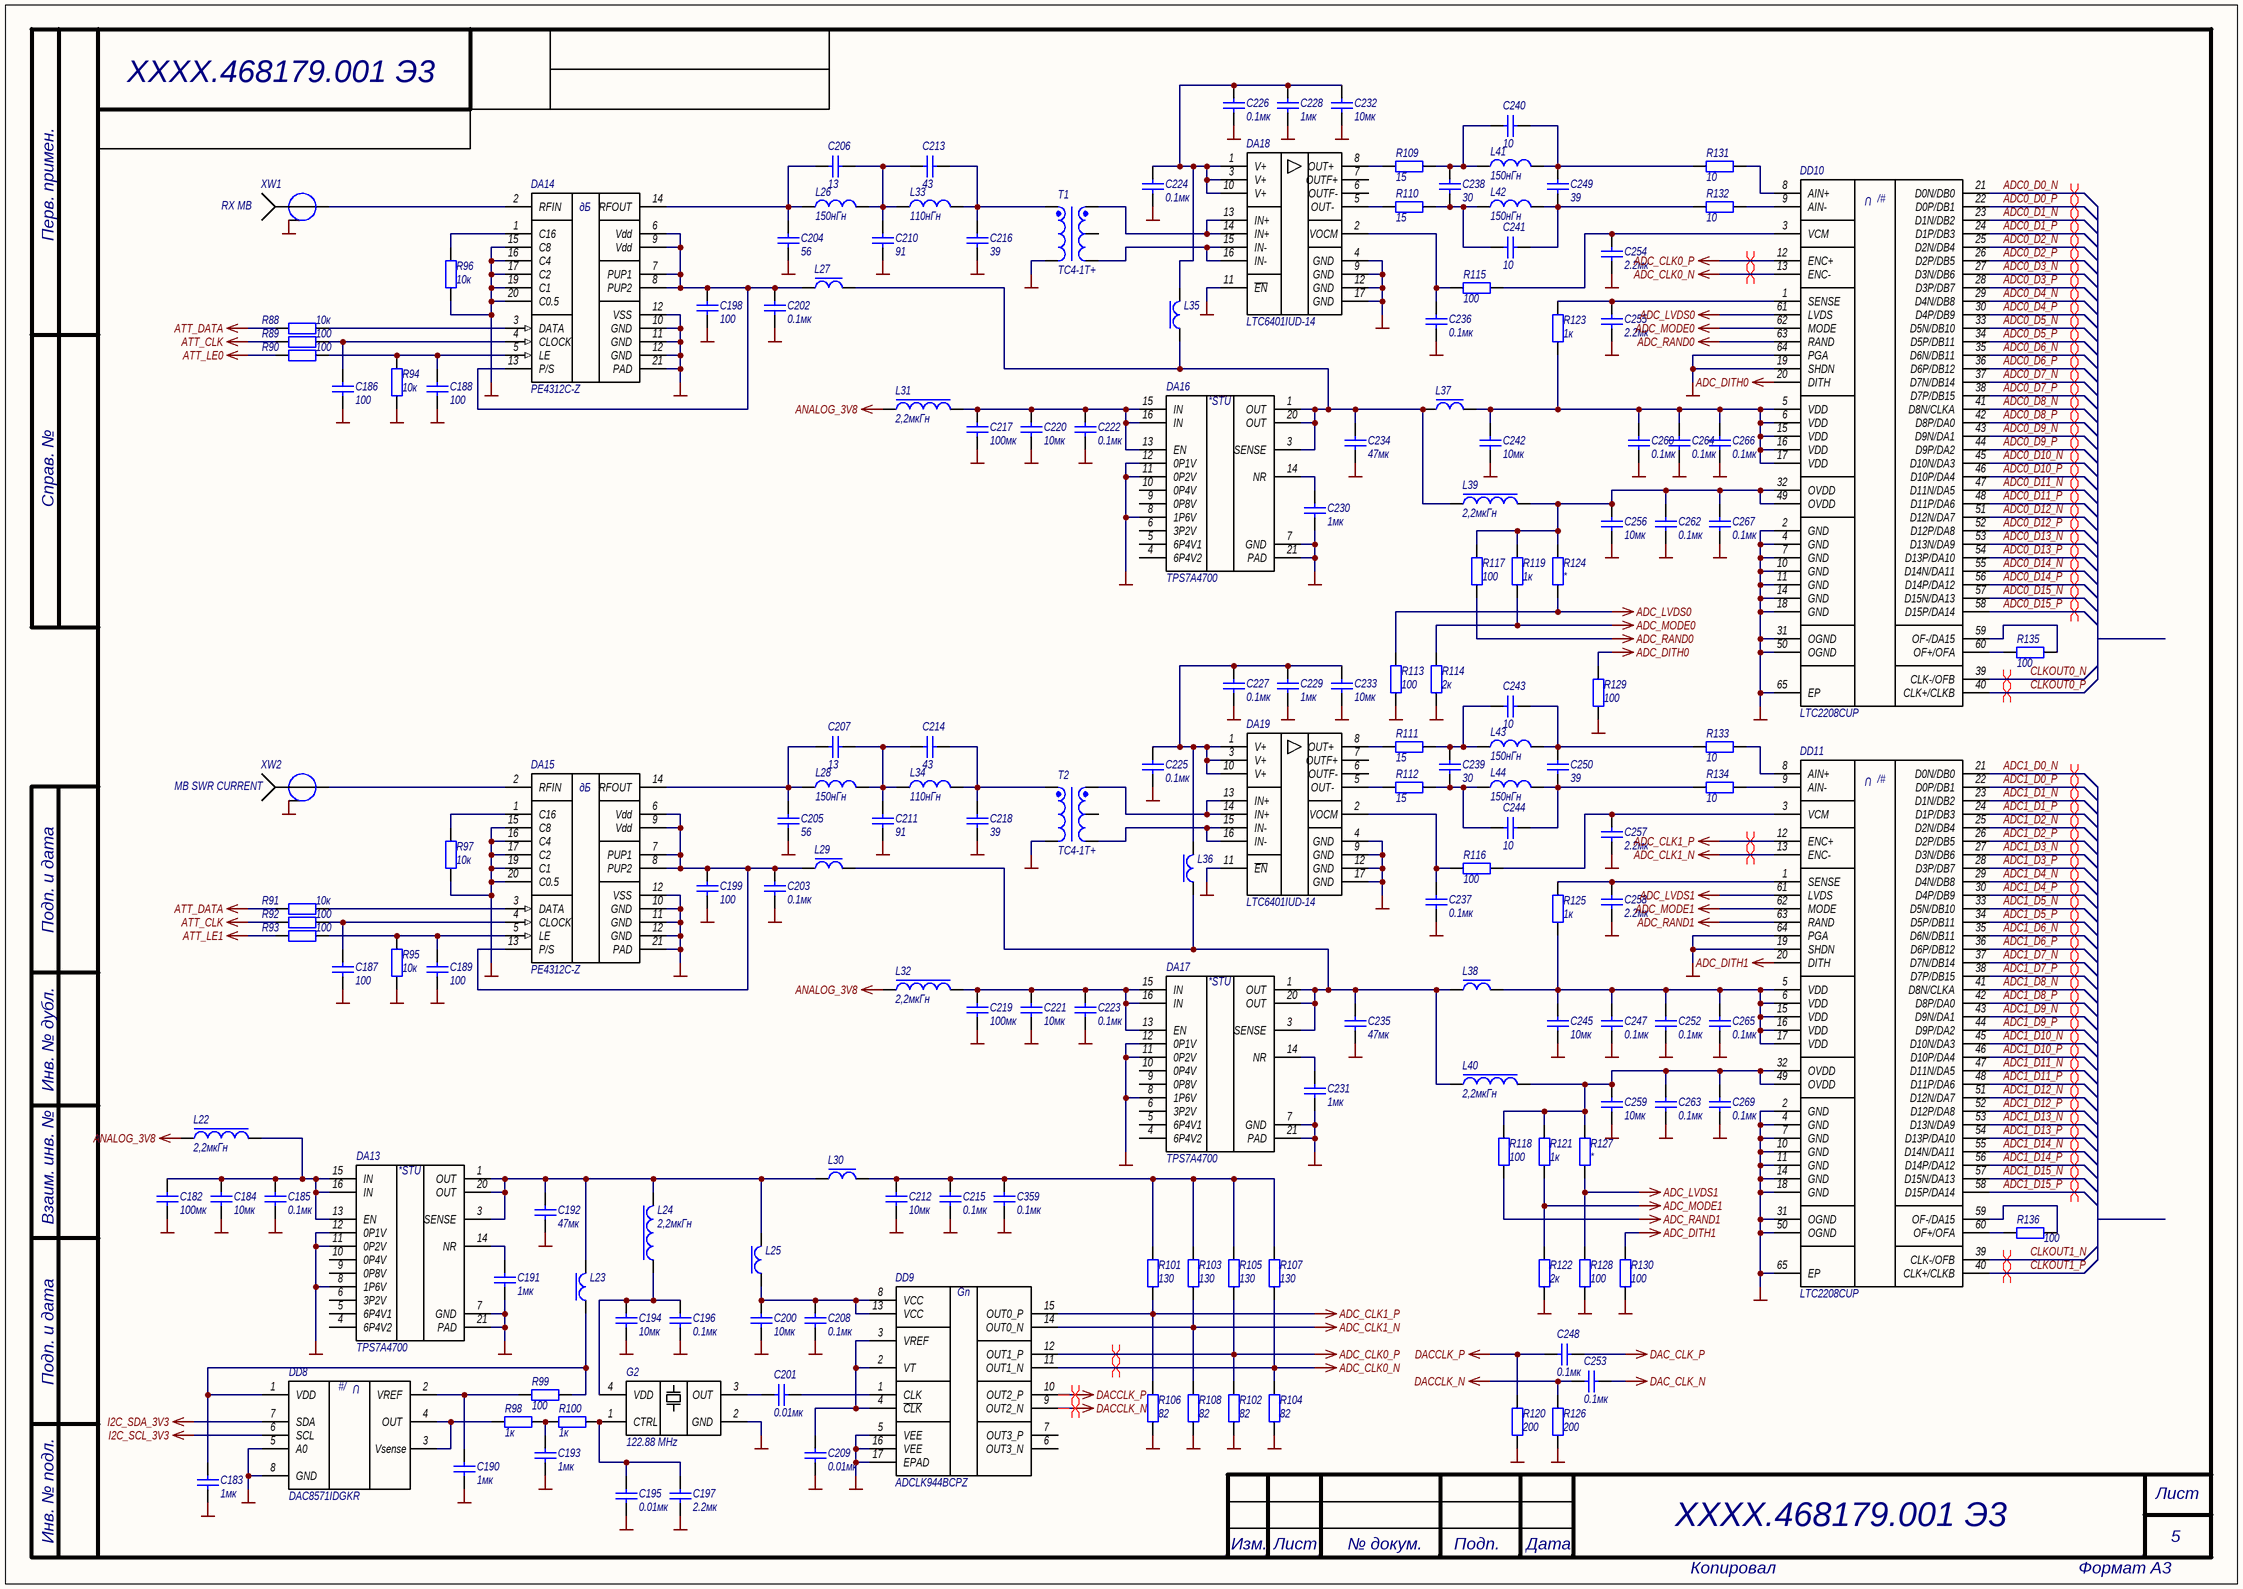
[diagram p4: MB_adc_clk.SchDoc]

### Parts
C182  100мк  [CAPC3216X19L]
C183  1мк  [CAPC1005X06N]
C184  10мк  [CAPC1608X08L]
C185  0.1мк  [CAPC1005X06N]
C186  100  [CAPC1005X06N]
C187  100  [CAPC1005X06N]
C188  100  [CAPC1005X06N]
C189  100  [CAPC1005X06N]
C190  1мк  [CAPC1005X06N]
C191  1мк  [CAPC1005X06N]
C192  47мк  [CAPC2012X12L]
C193  1мк  [CAPC1005X06N]
C194  10мк  [CAPC1608X08L]
C195  0.01мк  [CAPC1005X06N]
C196  0.1мк  [CAPC1005X06N]
C197  2.2мк  [CAPC1005X06N]
C198  100  [CAPC1005X06N]
C199  100  [CAPC1005X06N]
C200  10мк  [CAPC1608X08L]
C201  0.01мк  [CAPC1005X06N]
C202  0.1мк  [CAPC1005X06N]
C203  0.1мк  [CAPC1005X06N]
C204  56  [CAPC1005X06N]
C205  56  [CAPC1005X06N]
C206  13  [CAPC1005X06N]
C207  13  [CAPC1005X06N]
C208  0.1мк  [CAPC1005X06N]
C209  0.01мк  [CAPC1005X06N]
C210  91  [CAPC1005X06N]
C211  91  [CAPC1005X06N]
C212  10мк  [CAPC1608X08L]
C213  43  [CAPC1005X06N]
C214  43  [CAPC1005X06N]
C215  0.1мк  [CAPC1005X06N]
C216  39  [CAPC1005X06N]
C217  100мк  [CAPC3216X19L]
C218  39  [CAPC1005X06N]
C219  100мк  [CAPC3216X19L]
C220  10мк  [CAPC1608X08L]
C221  10мк  [CAPC1608X08L]
C222  0.1мк  [CAPC1005X06N]
C223  0.1мк  [CAPC1005X06N]
C224  0.1мк  [CAPC1005X06N]
C225  0.1мк  [CAPC1005X06N]
C226  0.1мк  [CAPC1005X06N]
C227  0.1мк  [CAPC1005X06N]
C228  1мк  [CAPC1005X06N]
C229  1мк  [CAPC1005X06N]
C230  1мк  [CAPC1005X06N]
C231  1мк  [CAPC1005X06N]
C232  10мк  [CAPC1608X08L]
C233  10мк  [CAPC1608X08L]
C234  47мк  [CAPC2012X12L]
C235  47мк  [CAPC2012X12L]
C236  0.1мк  [CAPC1005X06N]
C237  0.1мк  [CAPC1005X06N]
C238  30  [CAPC1005X06N]
C239  30  [CAPC1005X06N]
C240  10  [CAPC1005X06N]
C241  10  [CAPC1005X06N]
C242  10мк  [CAPC1608X08L]
C243  10  [CAPC1005X06N]
C244  10  [CAPC1005X06N]
C245  10мк  [CAPC1608X08L]
C247  0.1мк  [CAPC1005X06N]
C248  0.1мк  [CAPC1005X06N]
C249  39  [CAPC1005X06N]
C250  39  [CAPC1005X06N]
C252  0.1мк  [CAPC1005X06N]
C253  0.1мк  [CAPC1005X06N]
C254  2.2мк  [CAPC1005X06N]
C255  2.2мк  [CAPC1005X06N]
C256  10мк  [CAPC1608X08L]
C257  2.2мк  [CAPC1005X06N]
C258  2.2мк  [CAPC1005X06N]
C259  10мк  [CAPC1608X08L]
C260  0.1мк  [CAPC1005X06N]
C262  0.1мк  [CAPC1005X06N]
C263  0.1мк  [CAPC1005X06N]
C264  0.1мк  [CAPC1005X06N]
C265  0.1мк  [CAPC1005X06N]
C266  0.1мк  [CAPC1005X06N]
C267  0.1мк  [CAPC1005X06N]
C269  0.1мк  [CAPC1005X06N]
C359  0.1мк  [CAPC1005X06N]
DA13  TPS7A4700  [QFN65P500X500X100_HS-21L]
DA14  PE4312C-Z  [QFN50P400X400X80_HS-21L]
DA15  PE4312C-Z  [QFN50P400X400X80_HS-21L]
DA16  TPS7A4700  [QFN65P500X500X100_HS-21L]
DA17  TPS7A4700  [QFN65P500X500X100_HS-21L]
DA18  LTC6401IUD-14  [QFN50P300X300X75_HS-17L]
DA19  LTC6401IUD-14  [QFN50P300X300X75_HS-17L]
DD8  DAC8571IDGKR  [TSOP65P490X110-8L]
DD9  ADCLK944BCPZ  [QFN50P300X300X100_HS-17L]
DD10  LTC2208CUP  [QFN50P900X900X100_HS-65L]
DD11  LTC2208CUP  [QFN50P900X900X100_HS-65L]
G2  122.88 MHz  [CVHD-950 Model]
L22  2,2мкГн  [CSAB0420]
L23  BLM18PG121SN1D  [INDC1608X08L]  (value not drawn)
L24  2,2мкГн  [CSAB0420]
L25  BLM18PG121SN1D  [INDC1608X08L]  (value not drawn)
L26  150нГн  [INDC0805CS]
L27  BLM18PG121SN1D  [INDC1608X08L]  (value not drawn)
L28  150нГн  [INDC0805CS]
L29  BLM18PG121SN1D  [INDC1608X08L]  (value not drawn)
L30  BLM18PG121SN1D  [INDC1608X08L]  (value not drawn)
L31  2,2мкГн  [CSAB0420]
L32  2,2мкГн  [CSAB0420]
L33  110нГн  [INDC0805CS]
L34  110нГн  [INDC0805CS]
L35  BLM18PG121SN1D  [INDC1608X08L]  (value not drawn)
L36  BLM18PG121SN1D  [INDC1608X08L]  (value not drawn)
L37  BLM18PG121SN1D  [INDC1608X08L]  (value not drawn)
L38  BLM18PG121SN1D  [INDC1608X08L]  (value not drawn)
L39  2,2мкГн  [CSAB0420]
L40  2,2мкГн  [CSAB0420]
L41  150нГн  [INDC0805CS]
L42  150нГн  [INDC0805CS]
L43  150нГн  [INDC0805CS]
L44  150нГн  [INDC0805CS]
R88  10к  [RESC1005X06N]
R89  100  [RESC1005X06N]
R90  100  [RESC1005X06N]
R91  10к  [RESC1005X06N]
R92  100  [RESC1005X06N]
R93  100  [RESC1005X06N]
R94  10к  [RESC1005X06N]
R95  10к  [RESC1005X06N]
R96  10к  [RESC1005X06N]
R97  10к  [RESC1005X06N]
R98  1к  [RESC1005X06N]
R99  100  [RESC1005X06N]
R100  1к  [RESC1005X06N]
R101  130  [RESC1005X06N]
R102  82  [RESC1005X06N]
R103  130  [RESC1005X06N]
R104  82  [RESC1005X06N]
R105  130  [RESC1005X06N]
R106  82  [RESC1005X06N]
R107  130  [RESC1005X06N]
R108  82  [RESC1005X06N]
R109  15  [RESC1005X06N]
R110  15  [RESC1005X06N]
R111  15  [RESC1005X06N]
R112  15  [RESC1005X06N]
R113  100  [RESC1005X06N]
R114  2к  [RESC1005X06N]
R115  100  [RESC1005X06N]
R116  100  [RESC1005X06N]
R117  100  [RESC1005X06N]
R118  100  [RESC1005X06N]
R119  1к  [RESC1005X06N]
R120  200  [RESC1005X06N]
R121  1к  [RESC1005X06N]
R122  2к  [RESC1005X06N]
R123  1к  [RESC1005X06N]
R124  *  [RESC1005X06N]
R125  1к  [RESC1005X06N]
R126  200  [RESC1005X06N]
R127  *  [RESC1005X06N]
R128  100  [RESC1005X06N]
R129  100  [RESC1005X06N]
R130  100  [RESC1005X06N]
R131  10  [RESC1005X06N]
R132  10  [RESC1005X06N]
R133  10  [RESC1005X06N]
R134  10  [RESC1005X06N]
R135  100  [RESC1005X06N]
R136  100  [RESC1005X06N]
T1  TC4-1T+  [SM-22 package]
T2  TC4-1T+  [SM-22 package]
XW1  SMA-JR  [SMA-JR]  (value not drawn)
XW2  SMA-JR  [SMA-JR]  (value not drawn)

### Nets
ADC_CLK0_N: DD9.11(OUT1_N) DD10.13(ENC-) R104.1 R107.2
ADC_CLK0_P: DD9.12(OUT1_P) DD10.12(ENC+) R102.1 R105.2
ADC_CLK1_N: DD9.14(OUT0_N) DD11.13(ENC-) R103.2 R108.1
ADC_CLK1_P: DD9.15(OUT0_P) DD11.12(ENC+) R101.2 R106.1
ADC_DITH0: DD10.20(DITH) R129.1
ADC_DITH1: DD11.20(DITH) R130.1
ADC_LVDS0: DD10.61(LVDS) R113.1 R124.2
ADC_LVDS1: DD11.61(LVDS) R127.2 R128.1
ADC_MODE0: DD10.62(MODE) R114.1 R119.2
ADC_MODE1: DD11.62(MODE) R121.2 R122.1
ADC_RAND0: DD10.63(RAND) R117.2
ADC_RAND1: DD11.63(RAND) R118.2
ANALOG_3V8: L22.1 L31.1 L32.1
ATT_CLK: R89.2 R92.2
ATT_DATA: R88.2 R91.2
ATT_LE0: R90.2
ATT_LE1: R93.2
DAC_CLK_N: C253.1
DAC_CLK_P: C248.1
DACCLK_N: C253.2 DD9.9(OUT2_N) R126.1
DACCLK_P: C248.2 DD9.10(OUT2_P) R120.1
GND: C182.1 C183.2 C184.1 C185.1 C186.1 C187.1 C188.1 C189.1 C190.2 C191.1 C192.1 C193.2 C194.1 C195.2 C196.1 C197.1 C198.1 C199.1 C200.1 C202.1 C203.1 C204.1 C205.1 C208.1 C209.2 C210.1 C211.1 C212.1 C215.1 C216.1 C217.1 C218.1 C219.1 C220.1 C221.1 C222.1 C223.1 C224.1 C225.1 C226.1 C227.1 C228.1 C229.1 C230.1 C231.1 C232.1 C233.1 C234.1 C235.1 C236.1 C237.1 C242.1 C245.1 C247.1 C252.1 C254.1 C255.1 C256.1 C257.1 C258.1 C259.1 C260.1 C262.1 C263.1 C264.1 C265.1 C266.1 C267.1 C269.1 C359.1 DA13.7(GND) DA13.8(1P6V) DA13.11(0P2V) DA13.12(0P1V) DA13.21(PAD) DA14.10(GND) DA14.11(GND) DA14.12(VSS) DA14.15(C8) DA14.16(C4) DA14.17(C2) DA14.19(C1) DA14.20(C0.5) DA14.21(PAD) DA15.10(GND) DA15.11(GND) DA15.12(VSS) DA15.15(C8) DA15.16(C4) DA15.17(C2) DA15.19(C1) DA15.20(C0.5) DA15.21(PAD) DA16.7(GND) DA16.8(1P6V) DA16.11(0P2V) DA16.12(0P1V) DA16.21(PAD) DA17.7(GND) DA17.8(1P6V) DA17.11(0P2V) DA17.12(0P1V) DA17.21(PAD) DA18.4(GND) DA18.9(GND) DA18.11(~{EN}) DA18.12(GND) DA18.17(GND) DA19.4(GND) DA19.9(GND) DA19.11(~{EN}) DA19.12(GND) DA19.17(GND) DD8.5(A0) DD8.8(GND) DD9.5(VEE) DD9.16(VEE) DD9.17(EPAD) DD10.2(GND) DD10.4(GND) DD10.7(GND) DD10.10(GND) DD10.11(GND) DD10.14(GND) DD10.18(GND) DD10.19(SHDN) DD10.31(OGND) DD10.50(OGND) DD10.64(PGA) DD10.65(EP) DD11.2(GND) DD11.4(GND) DD11.7(GND) DD11.10(GND) DD11.11(GND) DD11.14(GND) DD11.18(GND) DD11.19(SHDN) DD11.31(OGND) DD11.50(OGND) DD11.64(PGA) DD11.65(EP) G2.2(GND) R94.2 R95.2 R96.1 R97.1 R102.2 R104.2 R106.2 R108.2 R113.2 R114.2 R120.2 R122.2 R126.2 R128.2 R129.2 R130.2 T1.4(PRIMARY) T2.4(PRIMARY) XW1.2 XW2.2
I2C_SCL_3V3: DD8.6(SCL)
I2C_SDA_3V3: DD8.7(SDA)
ADC0_D0_N: DD10.21(D0N/DB0)
ADC0_D0_P: DD10.22(D0P/DB1)
ADC0_D1_N: DD10.23(D1N/DB2)
ADC0_D1_P: DD10.24(D1P/DB3)
ADC0_D2_N: DD10.25(D2N/DB4)
ADC0_D2_P: DD10.26(D2P/DB5)
ADC0_D3_N: DD10.27(D3N/DB6)
ADC0_D3_P: DD10.28(D3P/DB7)
ADC0_D4_N: DD10.29(D4N/DB8)
ADC0_D4_P: DD10.30(D4P/DB9)
ADC0_D5_N: DD10.33(D5N/DB10)
ADC0_D5_P: DD10.34(D5P/DB11)
ADC0_D6_N: DD10.35(D6N/DB11)
ADC0_D6_P: DD10.36(D6P/DB12)
ADC0_D7_N: DD10.37(D7N/DB14)
ADC0_D7_P: DD10.38(D7P/DB15)
ADC0_D8_N: DD10.41(D8N/CLKA)
ADC0_D8_P: DD10.42(D8P/DA0)
ADC0_D9_N: DD10.43(D9N/DA1)
ADC0_D9_P: DD10.44(D9P/DA2)
ADC0_D10_N: DD10.45(D10N/DA3)
ADC0_D10_P: DD10.46(D10P/DA4)
ADC0_D11_N: DD10.47(D11N/DA5)
ADC0_D11_P: DD10.48(D11P/DA6)
ADC0_D12_N: DD10.51(D12N/DA7)
ADC0_D12_P: DD10.52(D12P/DA8)
ADC0_D13_N: DD10.53(D13N/DA9)
ADC0_D13_P: DD10.54(D13P/DA10)
ADC0_D14_N: DD10.55(D14N/DA11)
ADC0_D14_P: DD10.56(D14P/DA12)
ADC0_D15_N: DD10.57(D15N/DA13)
ADC0_D15_P: DD10.58(D15P/DA14)
ADC1_D0_N: DD11.21(D0N/DB0)
ADC1_D0_P: DD11.22(D0P/DB1)
ADC1_D1_N: DD11.23(D1N/DB2)
ADC1_D1_P: DD11.24(D1P/DB3)
ADC1_D2_N: DD11.25(D2N/DB4)
ADC1_D2_P: DD11.26(D2P/DB5)
ADC1_D3_N: DD11.27(D3N/DB6)
ADC1_D3_P: DD11.28(D3P/DB7)
ADC1_D4_N: DD11.29(D4N/DB8)
ADC1_D4_P: DD11.30(D4P/DB9)
ADC1_D5_N: DD11.33(D5N/DB10)
ADC1_D5_P: DD11.34(D5P/DB11)
ADC1_D6_N: DD11.35(D6N/DB11)
ADC1_D6_P: DD11.36(D6P/DB12)
ADC1_D7_N: DD11.37(D7N/DB14)
ADC1_D7_P: DD11.38(D7P/DB15)
ADC1_D8_N: DD11.41(D8N/CLKA)
ADC1_D8_P: DD11.42(D8P/DA0)
ADC1_D9_N: DD11.43(D9N/DA1)
ADC1_D9_P: DD11.44(D9P/DA2)
ADC1_D10_N: DD11.45(D10N/DA3)
ADC1_D10_P: DD11.46(D10P/DA4)
ADC1_D11_N: DD11.47(D11N/DA5)
ADC1_D11_P: DD11.48(D11P/DA6)
ADC1_D12_N: DD11.51(D12N/DA7)
ADC1_D12_P: DD11.52(D12P/DA8)
ADC1_D13_N: DD11.53(D13N/DA9)
ADC1_D13_P: DD11.54(D13P/DA10)
ADC1_D14_N: DD11.55(D14N/DA11)
ADC1_D14_P: DD11.56(D14P/DA12)
ADC1_D15_N: DD11.57(D15N/DA13)
ADC1_D15_P: DD11.58(D15P/DA14)
CLKOUT0_N: DD10.39(CLK-/OFB)
CLKOUT0_P: DD10.40(CLK+/CLKB)
CLKOUT1_N: DD11.39(CLK-/OFB)
CLKOUT1_P: DD11.40(CLK+/CLKB)
NetC182_2: C182.2 C184.2 C185.2 DA13.13(EN) DA13.15(IN) DA13.16(IN) L22.2
NetC183_1: C183.1 DD8.1(VDD) L23.1 R99.2
NetC186_2: C186.2 DA14.4(CLOCK) R89.1
NetC187_2: C187.2 DA15.4(CLOCK) R92.1
NetC188_2: C188.2 DA14.5(LE) R90.1 R94.1
NetC189_2: C189.2 DA15.5(LE) R93.1 R95.1
NetC190_1: C190.1 DD8.2(VREF) R99.1
NetC191_2: C191.2 DA13.14(NR)
NetC192_2: C192.2 DA13.1(OUT) DA13.3(SENSE) DA13.20(OUT) L23.2 L24.2 L25.2 L30.1
NetC193_1: C193.1 R98.2 R100.1
NetC194_2: C194.2 C196.2 G2.4(VDD) L24.1
NetC195_1: C195.1 C197.2 G2.1(CTRL) R100.2
NetC198_2: C198.2 C202.2 DA14.6(Vdd) DA14.7(PUP1) DA14.8(PUP2) DA14.9(Vdd) DA14.13(P/S) L27.1
NetC199_2: C199.2 C203.2 DA15.6(Vdd) DA15.7(PUP1) DA15.8(PUP2) DA15.9(Vdd) DA15.13(P/S) L29.1
NetC200_2: C200.2 C208.2 DD9.8(VCC) DD9.13(VCC) L25.1
NetC201_1: C201.1 DD9.1(CLK)
NetC201_2: C201.2 G2.3(OUT)
NetC204_2: C204.2 C206.2 DA14.14(RFOUT) L26.1
NetC205_2: C205.2 C207.2 DA15.14(RFOUT) L28.1
NetC206_1: C206.1 C210.2 C213.2 L26.2 L33.1
NetC207_1: C207.1 C211.2 C214.2 L28.2 L34.1
NetC209_1: C209.1 DD9.2(VT) DD9.3(VREF) DD9.4(~{CLK})
NetC212_2: C212.2 C215.2 C359.2 L30.2 R101.1 R103.1 R105.1 R107.1
NetC213_1: C213.1 C216.2 L33.2 T1.5(PRIMARY_DOT)
NetC214_1: C214.1 C218.2 L34.2 T2.5(PRIMARY_DOT)
NetC217_2: C217.2 C220.2 C222.2 DA16.13(EN) DA16.15(IN) DA16.16(IN) L31.2
NetC219_2: C219.2 C221.2 C223.2 DA17.13(EN) DA17.15(IN) DA17.16(IN) L32.2
NetC224_2: C224.2 C226.2 C228.2 C232.2 DA18.1(V+) DA18.3(V+) DA18.10(V+) L35.2
NetC225_2: C225.2 C227.2 C229.2 C233.2 DA19.1(V+) DA19.3(V+) DA19.10(V+) L36.2
NetC230_2: C230.2 DA16.14(NR)
NetC231_2: C231.2 DA17.14(NR)
NetC234_2: C234.2 DA16.1(OUT) DA16.3(SENSE) DA16.20(OUT) L27.2 L35.1 L37.1 L39.1
NetC235_2: C235.2 DA17.1(OUT) DA17.3(SENSE) DA17.20(OUT) L29.2 L36.1 L38.1 L40.1
NetC236_2: C236.2 DA18.2(VOCM) R115.1
NetC237_2: C237.2 DA19.2(VOCM) R116.1
NetC238_1: C238.1 C241.2 L42.1 R110.2
NetC238_2: C238.2 C240.2 L41.1 R109.2
NetC239_1: C239.1 C244.2 L44.1 R112.2
NetC239_2: C239.2 C243.2 L43.1 R111.2
NetC240_1: C240.1 C249.2 L41.2 R131.1
NetC241_1: C241.1 C249.1 L42.2 R132.1
NetC242_2: C242.2 C260.2 C264.2 C266.2 DD10.5(VDD) DD10.6(VDD) DD10.15(VDD) DD10.16(VDD) DD10.17(VDD) L37.2 R123.2
NetC243_1: C243.1 C250.2 L43.2 R133.1
NetC244_1: C244.1 C250.1 L44.2 R134.1
NetC245_2: C245.2 C247.2 C252.2 C265.2 DD11.5(VDD) DD11.6(VDD) DD11.15(VDD) DD11.16(VDD) DD11.17(VDD) L38.2 R125.2
NetC254_2: C254.2 DD10.3(VCM) R115.2
NetC255_2: C255.2 DD10.1(SENSE) R123.1
NetC256_2: C256.2 C262.2 C267.2 DD10.32(OVDD) DD10.49(OVDD) L39.2 R117.1 R119.1 R124.1
NetC257_2: C257.2 DD11.3(VCM) R116.2
NetC258_2: C258.2 DD11.1(SENSE) R125.1
NetC259_2: C259.2 C263.2 C269.2 DD11.32(OVDD) DD11.49(OVDD) L40.2 R118.1 R121.1 R127.1
NetDA14_1: DA14.1(C16) R96.2
NetDA14_2: DA14.2(RFIN) XW1.1
NetDA14_3: DA14.3(DATA) R88.1
NetDA15_1: DA15.1(C16) R97.2
NetDA15_2: DA15.2(RFIN) XW2.1
NetDA15_3: DA15.3(DATA) R91.1
NetDA18_5: DA18.5(GND) R110.1
NetDA18_8: DA18.8(OUT+) R109.1
NetDA18_13: DA18.13(IN+) DA18.14(IN+) T1.1(SECONDARY_DOT)
NetDA18_15: DA18.15(IN-) DA18.16(IN-) T1.3(SECONDARY)
NetDA19_5: DA19.5(GND) R112.1
NetDA19_8: DA19.8(OUT+) R111.1
NetDA19_13: DA19.13(IN+) DA19.14(IN+) T2.1(SECONDARY_DOT)
NetDA19_15: DA19.15(IN-) DA19.16(IN-) T2.3(SECONDARY)
NetDD8_3: DD8.3(Vsense) DD8.4(OUT) R98.1
NetDD10_8: DD10.8(AIN+) R131.2
NetDD10_9: DD10.9(AIN-) R132.2
NetDD10_59: DD10.59(OF-/DA15) R135.1
NetDD10_60: DD10.60(OF+/OFA) R135.2
NetDD11_8: DD11.8(AIN+) R133.2
NetDD11_9: DD11.9(AIN-) R134.2
NetDD11_59: DD11.59(OF-/DA15) R136.1
NetDD11_60: DD11.60(OF+/OFA) R136.2

Not connected (* = marked no-connect by the designer): DA13 4(6P4V2) 5(6P4V1) 6(3P2V) 9(0P8V) 10(0P4V); DA16 4(6P4V2) 5(6P4V1) 6(3P2V) 9(0P8V) 10(0P4V); DA17 4(6P4V2) 5(6P4V1) 6(3P2V) 9(0P8V) 10(0P4V); DA18 6(OUTF-) 7(OUTF+); DA19 6(OUTF-) 7(OUTF+); DD9 6(OUT3_N) 7(OUT3_P); T1 2(SECONARY_CT); T2 2(SECONARY_CT)

### Layout directives
differential pair: ADC0_D0_N, ADC0_D0_P, ADC0_D1_N, ADC0_D1_P, ADC0_D2_N, ADC0_D2_P, ADC0_D3_N, ADC0_D3_P, ADC0_D4_N, ADC0_D4_P, ADC0_D5_N, ADC0_D5_P, ADC0_D6_N, ADC0_D6_P, ADC0_D7_N, ADC0_D7_P, ADC0_D8_N, ADC0_D8_P, ADC0_D9_N, ADC0_D9_P, ADC0_D10_N, ADC0_D10_P, ADC0_D11_N, ADC0_D11_P, ADC0_D12_N, ADC0_D12_P, ADC0_D13_N, ADC0_D13_P, ADC0_D14_N, ADC0_D14_P, ADC0_D15_N, ADC0_D15_P, ADC1_D0_N, ADC1_D0_P, ADC1_D1_N, ADC1_D1_P, ADC1_D2_N, ADC1_D2_P, ADC1_D3_N, ADC1_D3_P, ADC1_D4_N, ADC1_D4_P, ADC1_D5_N, ADC1_D5_P, ADC1_D6_N, ADC1_D6_P, ADC1_D7_N, ADC1_D7_P, ADC1_D8_N, ADC1_D8_P, ADC1_D9_N, ADC1_D9_P, ADC1_D10_N, ADC1_D10_P, ADC1_D11_N, ADC1_D11_P, ADC1_D12_N, ADC1_D12_P, ADC1_D13_N, ADC1_D13_P, ADC1_D14_N, ADC1_D14_P, ADC1_D15_N, ADC1_D15_P, ADC_CLK0_N, ADC_CLK0_P, ADC_CLK1_N, ADC_CLK1_P, CLKOUT0_N, CLKOUT0_P, CLKOUT1_N, CLKOUT1_P, DACCLK_N, DACCLK_P

### Notes on the sheet
- (near XW1) RX MB
- (near XW2) MB SWR CURRENT
- Перв. примен.
- Справ. №
- Подп. и дата
- Инв. № дубл.
- Взаим. инв. №
- Инв. № подл.
- Лист
- Изм.
- № докум.
- Подп.
- Дата
- Копировал
- Формат А3
- (in symbol Микросхема ADCLK944BCPZ) Gn
- (in symbol Микросхема DAC8571IDGKR) U; #/
- (in symbol Микросхема LTC2208CUP) U; /#
- (in symbol Микросхема PE4312C-Z) дБ
- (in symbol Микросхема TPS7A4700RGW) *STU

### Library data of the parts
C182 C217 C219 = Кер.ЧИП конд. 1206 100мкФ X5R 20% 6.3В: Кер. ЧИП-конденсатор; Manufacturer: Murata; ManufacturerPartNumber: GRM31CR60J107ME39L; Power/Voltage: 6.3В; TKE: X5R; Tolerance: ±20%; Value: 100мк
C183 C190 C191 C193 C228-C231 = Кер.ЧИП конд. 0402 1мкФ X5R 10%, 10В: Кер. ЧИП-конденсатор; Power/Voltage: 10В; TKE: X5R; Tolerance: ±10%; Value: 1мк; PackageReference: 0402
C184 C194 C200 C212 C220 C221 C232 C233 C242 C245 C256 C259 = Кер.ЧИП конд. 0603 10мкФ X5R 20% 6.3В: Кер. ЧИП-конденсатор; Manufacturer: Murata; ManufacturerPartNumber: GRM188R61A106KE69D; Power/Voltage: 6.3В; TKE: X5R; Tolerance: ±20%; Value: 10мк
C185 C196 C202 C203 C208 C215 C222-C227 C236 C237 C247 C248 C252 C253 C260 C262-C267 C269 C359 = Кер.ЧИП конд. 0402 0.1мкФ X7R 10%, 16В: Кер. ЧИП-конденсатор; Power/Voltage: 16В; TKE: X7R; Tolerance: ±10%; PackageReference: 0402; Value: 0.1мк
C186-C189 C198 C199 = Кер.ЧИП конд. 0402 100пФ NPO 5%, 50В: Кер. ЧИП-конденсатор; Power/Voltage: 50В; TKE: NPO; Tolerance: ±5%; PackageReference: 0402; Value: 100
C192 C234 C235 = Кер.ЧИП конд. 0805 47мкФ X5R 20% 10В: Кер. ЧИП-конденсатор; Manufacturer: Murata; ManufacturerPartNumber: GRM21BR61A476ME15L; Power/Voltage: 10В; TKE: X5R; Tolerance: ±20%; Value: 47мк
C195 C201 C209 = Кер.ЧИП конд. 0402 0.01мкФ X7R 10%, 50В: Кер. ЧИП-конденсатор; Power/Voltage: 50В; TKE: X7R; Tolerance: ±20%; Value: 0.01мк
C197 C254 C255 C257 C258 = Кер.ЧИП конд. 0402 2.2мкФ X5R 20%, 6.3В: Кер. ЧИП-конденсатор; Power/Voltage: 6.3В; TKE: X5R; Tolerance: ±20%; PackageReference: 0402; Value: 2.2мк
C204 C205 = Кер.ЧИП конд. 0402 56пФ NPO 5%, 50В: Кер. ЧИП-конденсатор; Power/Voltage: 50В; TKE: NPO; Tolerance: ±5%; PackageReference: 0402; Value: 56
C206 C207 = Кер.ЧИП конд. 0402 13пФ NPO 5%, 50В: Кер. ЧИП-конденсатор; Power/Voltage: 50В; TKE: NPO; Tolerance: ±5%; Value: 13; PackageReference: 0402
C210 C211 = Кер.ЧИП конд. 0402 91пФ NPO 5%, 50В: Кер. ЧИП-конденсатор; Power/Voltage: 50В; TKE: NPO; Tolerance: ±5%; PackageReference: 0402; Value: 91
C213 C214 = Кер.ЧИП конд. 0402 43пФ NPO 5%, 50В: Кер. ЧИП-конденсатор; Power/Voltage: 50В; TKE: NPO; Tolerance: ±5%; Value: 43; PackageReference: 0402
C216 C218 C249 C250 = Кер.ЧИП конд. 0402 39пФ NPO 5%, 50В: Кер. ЧИП-конденсатор; Power/Voltage: 50В; TKE: NPO; Tolerance: ±5%; PackageReference: 0402; Value: 39
C238 C239 = Кер.ЧИП конд. 0402 30пФ NPO 5%, 50В: Кер. ЧИП-конденсатор; Power/Voltage: 50В; TKE: NPO; Tolerance: ±5%; PackageReference: 0402; Value: 30
C240 C241 C243 C244 = Кер.ЧИП конд. 0402 10пФ NPO 5%, 50В: Кер. ЧИП-конденсатор; Power/Voltage: 50В; TKE: NPO; Tolerance: ±5%; PackageReference: 0402; Value: 10
DA13 DA16 DA17 = Микросхема TPS7A4700RGW: 36-V, 1-A, 4-µVRMS, RF LDO Voltage Regulator; Manufacturer: TI; Value: TPS7A4700; ComponentLink1Description: datasheet; ComponentLink1URL: http://www.ti.com/lit/ds/symlink/tps7a47.pdf
DA14 DA15 = Микросхема PE4312C-Z: RF Digital Step Attenuator 6-bit, 31.5 dB, 1 MHz–4 GHz; Manufacturer: Peregrine; Value: PE4312C-Z; ComponentLink1Description: datasheet; ComponentLink1URL: https://www.psemi.com/pdf/datasheets/pe4312ds.pdf
DA18 DA19 = Микросхема LTC6401IUD-14: 2GHz Low Noise, Low  Distortion Differential ADC  Driver for DC-140MHz; Manufacturer: LINEAR TECHNOLOGY; Value: LTC6401IUD-14; ComponentLink1Description: datasheet; ComponentLink1URL: http://cds.linear.com/docs/en/datasheet/640114f.pdf
DD8 = Микросхема DAC8571IDGKR: 16-BIT, LOW POWER, VOLTAGE OUTPUT, I2C INTERFACE DIGITAL-TO-ANALOG  CONVERTER; Manufacturer: TI; Value: DAC8571IDGKR; ComponentLink1Description: datasheet; ComponentLink1URL: http://www.ti.com/lit/ds/slas373a/slas373a.pdf
DD9 = Микросхема ADCLK944BCPZ: 2.5 V/3.3 V, Four LVPECL Outputs,  SiGe Clock Fanout Buffer; Manufacturer: TI; Value: ADCLK944BCPZ; ComponentLink1Description: datasheet; ComponentLink1URL: http://www.analog.com/media/en/technical-documentation/data-sheets/ADCLK944.pdf
DD10 DD11 = Микросхема LTC2208CUP: 16-Bit, 130Msps ADC; Manufactured: Linear; Value: LTC2208CUP; ComponentLink1Description: datasheet; ComponentLink1URL: https://www.analog.com/media/en/technical-documentation/data-sheets/2208fc.pdf
G2 = Генератор кварцевый CVHD-950-122.880: 122.88 MHz Ultra-Low Phase Noise Oscillator; Manufacturer: Crystek crystals; Value: 122.88 MHz; ComponentLink1Description: datasheet; ComponentLink1URL: http://www.rakon.com/products/families/tcxo
L22 L24 L31 L32 L39 L40 = ЧИП индуктивность CSAB0420-2R2M: Molding Power Choke; Manufacturer: Vishay; ManufacturerPartNumber: IHLP1616ABER1R0M11; Value: 2,2мкГн
L23 L25 L27 L29 L30 L35-L38 = ЧИП дроссель 0603 BLM18PG121SN1D: SMD EMI Suppression Filter EMIFIL; Manufacturer: Murata; ManufacturerPartNumber: BLM18PG121SN1D; Value: BLM18PG121SN1D
L26 L28 = ЧИП индуктивность 0805CS-151XGL: Value: 150нГн
L33 L34 = ЧИП индуктивность 0805CS-111XGL: Value: 110нГн
L41-L44 = ЧИП индуктивность 0805CS-150XJL: Value: 150нГн
R88 R91 R94-R97 = Чип резистор 0402 10 кОм, 5%: ЧИП-резистор; Tolerance: ±5%; TKE: 100 ppm/°С; PackageReference: 0402; Value: 10к
R89 R90 R92 R93 R99 R113 R115-R118 R128-R130 R135 R136 = Чип резистор 0402 100 Ом, 5%: ЧИП-резистор; Tolerance: ±5%; TKE: 100 ppm/°С; PackageReference: 0402; Value: 100
R98 R100 R119 R121 R123 R125 = Чип резистор 0402 1 кОм, 5%: ЧИП-резистор; Tolerance: ±5%; TKE: 100 ppm/°С; PackageReference: 0402; Value: 1к
R101 R103 R105 R107 = Чип резистор 0402 130 Ом, 5%: ЧИП-резистор; Tolerance: ±5%; TKE: 100 ppm/°С; PackageReference: 0402; Value: 130
R102 R104 R106 R108 = Чип резистор 0402 82 Ом, 5%: ЧИП-резистор; Tolerance: ±5%; TKE: 100 ppm/°С; PackageReference: 0402; Value: 82
R109-R112 = Чип резистор 0402 15 Ом, 5%: ЧИП-резистор; Tolerance: ±5%; TKE: 100 ppm/°С; PackageReference: 0402; Value: 15
R114 R122 = Чип резистор 0402 2 кОм, 5%: ЧИП-резистор; Tolerance: ±5%; TKE: 100 ppm/°С; PackageReference: 0402; Value: 2к
R120 R126 = Чип резистор 0402 200 Ом, 5%: ЧИП-резистор; Tolerance: ±5%; TKE: 100 ppm/°С; PackageReference: 0402; Value: 200
R124 R127 = Чип резистор 0402 *: ЧИП-резистор; Tolerance: ±5%; TKE: 100 ppm/°С; PackageReference: 0402; Value: *
R131-R134 = Чип резистор 0402 10 Ом, 5%: ЧИП-резистор; Tolerance: ±5%; TKE: 100 ppm/°С; PackageReference: 0402; Value: 10
T1 T2 = ЧИП трансформатор TC4-1T+: RF Transformer 50Ω 0.5 to 300 MHz 1:4; Manufacturer: minicircuits; ManufacturerPartNumber: ADT2-1T+; Value: TC4-1T+; ComponentLink1Description: datasheet; ComponentLink1URL: https://ww2.minicircuits.com/pdfs/ADT2-1T+.pdf
XW1 XW2 = Соединитель коаксиальный SMA-JR: SMA-JR Разъем SMA гнездо на плату, прямой угол; Value: SMA-JR; ComponentLink1Description: datasheet; ComponentLink1URL: http://www.brownbear.ru/goods/2243.html